# Altium schematic sheet parent_sheet.SchDoc
size A4
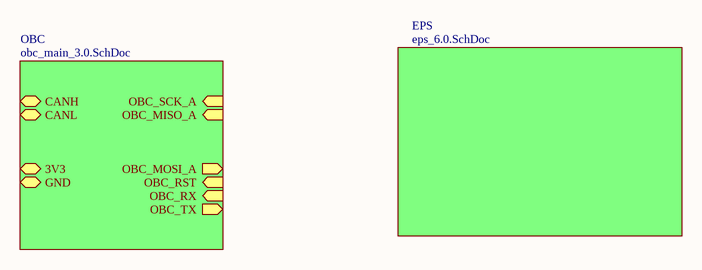
[diagram p0: parent_sheet.SchDoc]

## Sub-sheets
EPS = eps_6.0.SchDoc: no entries
OBC = obc_main_3.0.SchDoc: 3V3 (bidir), GND (bidir), CANH (bidir), CANL (bidir), OBC_SCK_A (in), OBC_MISO_A (in), OBC_MOSI_A (out), OBC_RST (in), OBC_RX (in), OBC_TX (out)